# EAGLE design pressure-balloon (EAGLE 6.0)
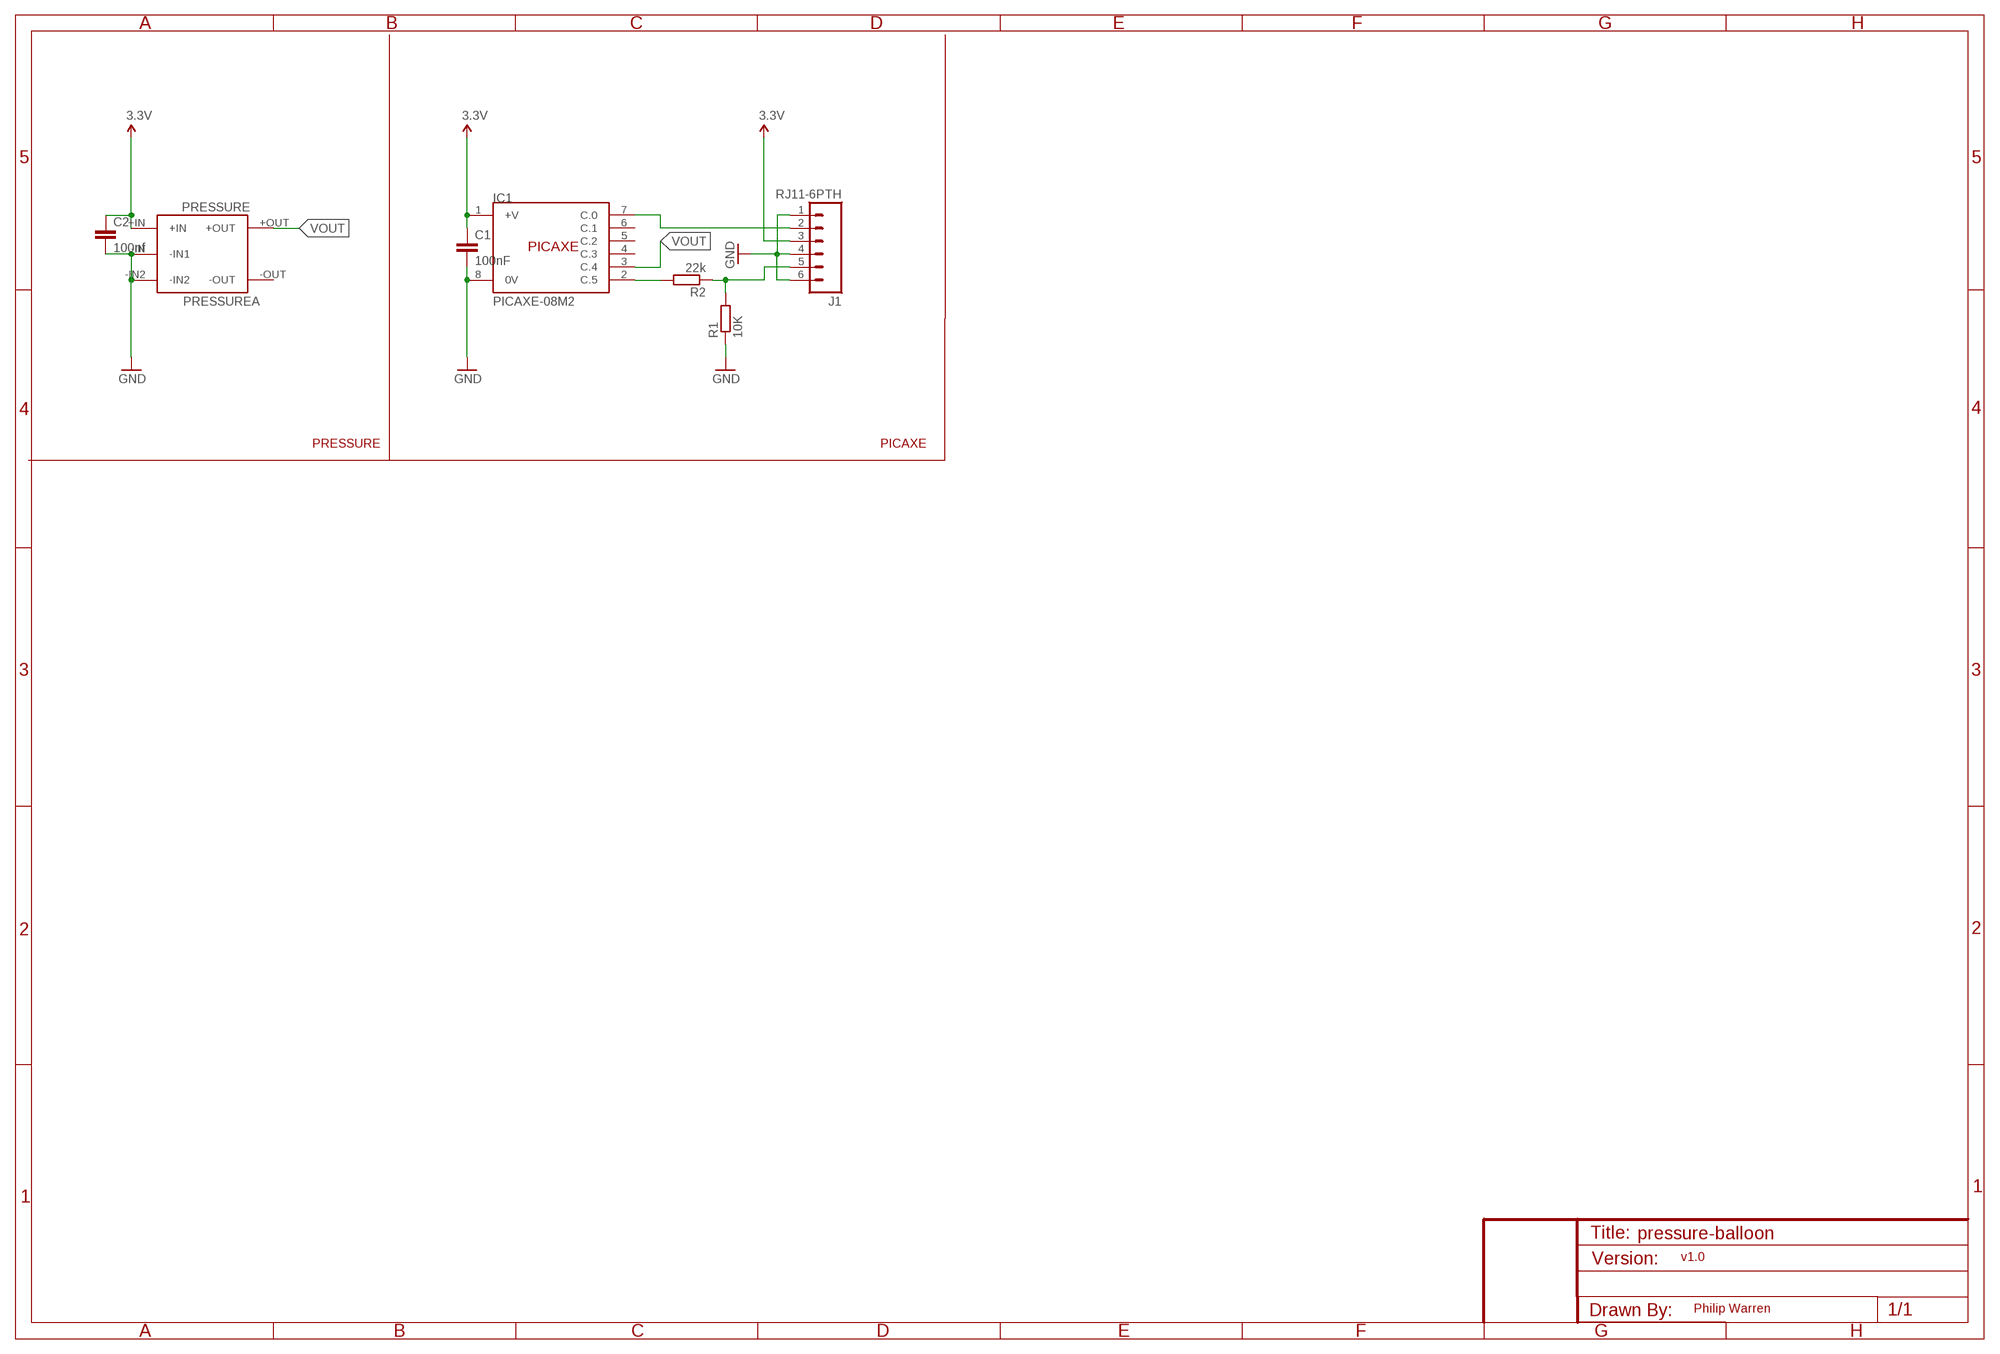
[diagram p0: schematic, sheet 1]

## Parts
C1  100nF  CAP0805  [0805]
C2  100nf  CAP0805  [0805]
IC1  PICAXE-08M2  [SOIC8]
J1  RJ11-6PTH  [RJ11-6]
PRESSURE  PRESSUREA  [PRESSURE]
R1  10K  R-EU_R0805  [R0805]
R2  22k  R-EU_R0805  [R0805]

## Nets
3.3V: C1.1 C2.1 IC1.1(+V) J1.3 PRESSURE.+IN
GND: C1.2 C2.2 IC1.8(0V) J1.1 J1.4 J1.6 PRESSURE.-IN2 PRESSURE.-IN(-IN1) R1.1
N$1: IC1.7(C.0) J1.2
N$2: J1.5 R1.2 R2.1
N$3: IC1.2(C.5) R2.2
VOUT: IC1.3(C.4) PRESSURE.+OUT
Unconnected: IC1.4(C.3) IC1.5(C.2) IC1.6(C.1) PRESSURE.-OUT

## Notes on the sheet
- PRESSURE | PICAXE
- v1.0
- Philip Warren

## Library data of the parts
C1 C2 = apex:CAP: Capacitor Standard 0603 ceramic capacitor, and 0.1" leaded capacitor.
IC1 = apex:PICAXE-08M2
J1 = apex:RJ11-6: RJ11 Jack Simple 6 pin RJ11 jack. Commonly found on CAT3 devices and Microchip programmers. SKU: PRT-00132
PRESSURE = mylibrary:PRESSURE: NPP-301 SMD http://uk.farnell.com/ge-sensing-novasensor/npp-301a-100at/pressure-sensor/dp/1433554?Ntt=1433554
R1 R2 = apex:R-EU_: RESISTOR, European symbol

## Board
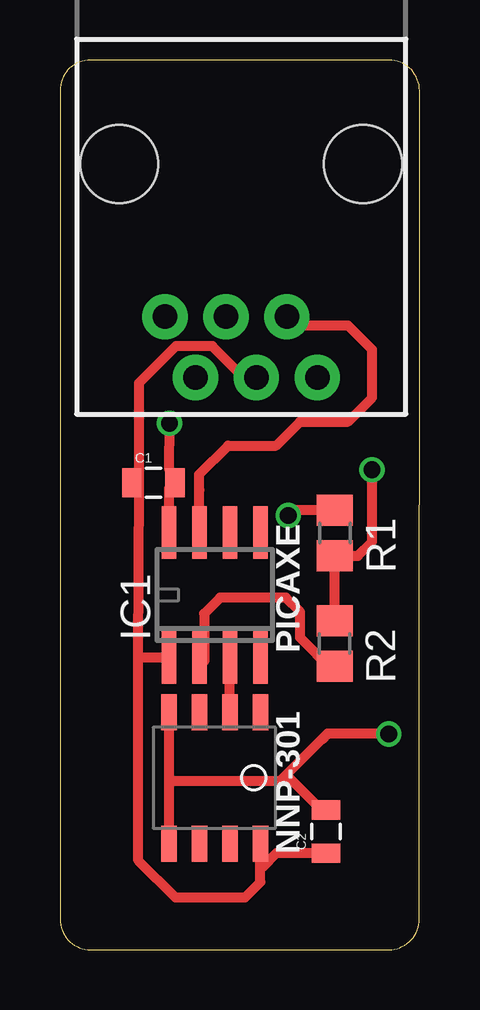
[diagram p1: board, top side]
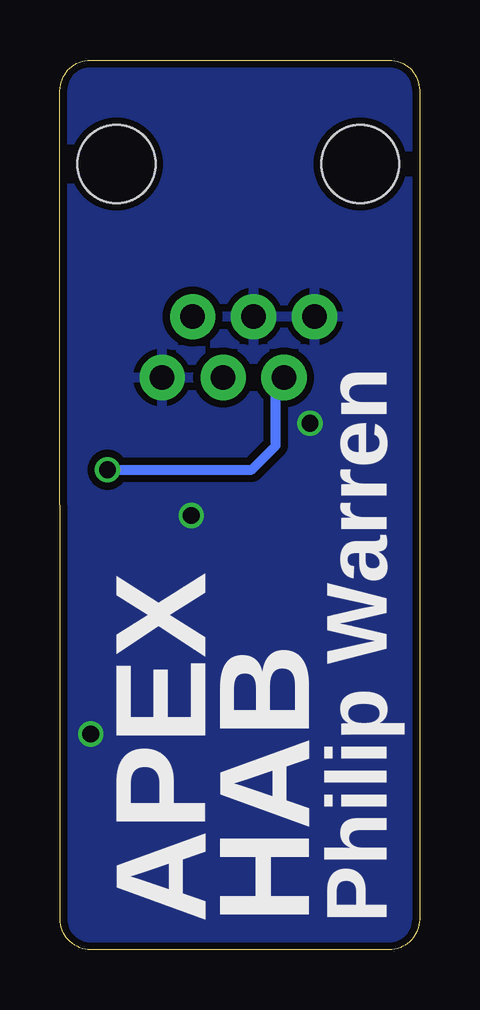
[diagram p2: board, bottom side, seen from below]

Size 14.98 x 37.07 mm. Coordinates in mm from the lower left corner, seen from the top.
Outline: 0,35.8 0,1.27 arc90 1.27,0 13.7,0 arc90 14.97,1.27 14.98,35.8 arc90 13.71,37.07 1.27,37.07 arc90 0,35.8
Copper layers (1*16): Top 0.035mm / dielectric 1.5mm / Bottom 0.035mm
Design rules: minimum track width 6mil, minimum drill 12mil, track to track 6mil, track to pad 6mil, pad to pad 6mil, via to via 6mil, smd to smd 0mil, copper to edge 10mil, drill to drill 10mil, minimum pad ring 10mil, minimum via ring 6mil, stop-mask expansion 2mil, vias tented up to drill 100mil, thermal gap 10mil

### Footprints (pad centres in the part's own frame; a part is rotated, then mirrored left to right if it is on the bottom)
0805 = smd 0.8 x 1.2: 1 -0.9,0; 2 0.9,0
SOIC8 = smd 0.6 x 2.2: 1 -1.905,-2.6; 2 -0.635,-2.6; 3 0.635,-2.6; 4 1.905,-2.6; 5 1.905,2.6; 6 0.635,2.6; 7 -0.635,2.6; 8 -1.905,2.6
RJ11-6 = drill 1.016 pad 1.88: 1 1.905,8.89; 2 3.175,6.35; 3 4.445,8.89; 4 5.715,6.35; 5 6.985,8.89; 6 8.255,6.35 | hole 3.251: 0,0; 10.16,0
PRESSURE = smd 1.5 x 0.65: +IN 2.74,1.27; +OUT -2.74,0; -IN -2.74,-2.54; -IN2 2.74,-2.54; -OUT 2.74,-1.27; NC1 -2.74,1.27; NC2 -2.74,-1.27; NC3 2.74,0
R0805 = smd 1.3 x 1.5: 1 -0.95,0; 2 0.95,0

### Placement (x,y rotation side)
C1  3.89,19.46 0 top
C2  11.08,4.92 90 top
IC1  6.45,14.78 0 top
J1  12.63,32.73 180 top
PRESSURE  7.08,7.16 270 top
R1  11.46,17.36 270 top
R2  11.45,12.76 270 top

### Tracks (layer width: path | path; a pad name or v marks a point on that pad's centre or on a via)
3.3V
  Top 0.406: 3.27,12.18 3.27,3.71 4.81,2.17 7.71,2.17 8.35,2.81 8.35,3.45 | 3.27,12.18 IC1.1 | 3.27,12.18 3.3,19.45 | 8.35,3.45 PRESSURE.+IN | 3.3,19.45 C1.1 | C2.1 9.02,4.02 8.42,3.42 8.42,3.45 8.35,3.45 | 3.3,19.45 3.3,23.62 4.83,25.15 6.35,25.15 7.66,23.84 J1.3
GND  (via drill 0.7)
  Top 0.406: v4.56,21.94 4.54,20.03 C1.2 4.68,19.64 4.82,19.41 4.54,19.23 IC1.8 4.54,17.32 | 4.54,3.98 PRESSURE.-IN2 4.56,4.43 | v9.51,18.09 9.72,18.31 R1.1 | PRESSURE.-IN 4.54,4.45 4.56,4.43 | 4.56,4.43 4.56,7.04 9.18,7.04 9.43,7.29 | 9.43,7.29 11.14,9 | 11.14,9 11.14,8.97 10.92,8.75 | C2.2 10.9,5.82 9.43,7.29 | v13.7,8.99 11.15,8.99 11.14,9
  pour Bottom (isolate 0.305): 0,37 0,1.27 arc90 1.27,0 13.73,0 arc90 15,1.27 15,37
N$1
  Top 0.406: IC1.7 5.81,19.16 5.8,19.71 5.8,19.8 7,21 9,21 10,22 12,22 13,23 13,25 12,26 9.84,26 J1.2
N$2  (via drill 0.7)
  Top 0.406: R2.1 R1.2 12.41,16.41 13,17 v13,20
  Bottom 0.406: v13,20 7,20 6,21 6,23.46 5.66,23.8 | 5.66,23.8 5.8,23.8 | J1.5 5.64,23.82 5.66,23.8
N$3
  Top 0.406: IC1.2 6,12 6,14 6.67,14.67 9.41,14.67 10,14.08 10,13 11.33,11.67 R2.2
VOUT
  Top 0.406: PRESSURE.+OUT IC1.3

### Text on the board
tPlace: PICAXE | NNP-301
bPlace: Philip Warren | HAB | APEX